# Altium schematic sheet 1_P1.schdoc
size 417 x 295 mm
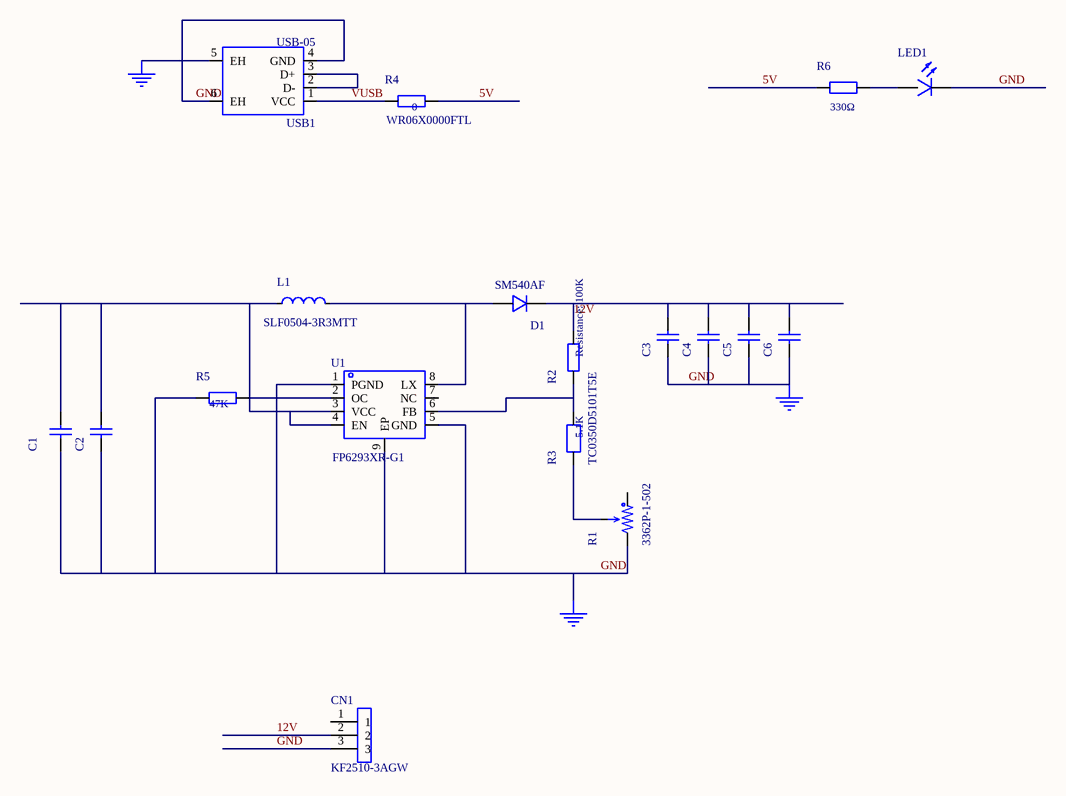
[diagram p0: 1_P1.schdoc]

## Parts
C1  (no value)  [C0805]
C2  (no value)  [C0805]
C3  (no value)  [C0805]
C4  (no value)  [C0805]
C5  (no value)  [C0805]
C6  (no value)  [C0805]
CN1  (no value)  [HDR-TH_3P-P2.54-H-W10.0]
D1  (no value)  [SMAF_L3.5-W2.6-LS4.7-RD]
L1  (no value)  [IND-SMD_L5.8-W5.2]
LED1  (no value)  [LED0603-R-RD]
R1  (no value)  [RES-ADJ-TH_3362P]
R2  Resistance: 100K  [R0805]
R3  Resistance: 5.1K  [R0603]
R4  Resistance: 0  [R0603]
R5  Resistance: 47K  [R0603]
R6  Resistance: 330Ω  [R0603]
U1  (no value)  [SOP-8_L4.9-W3.9-P1.27-LS6.0-BL-EP]
USB1  (no value)  [USB-A-TH_48037-0001]

## Nets
GND: C1.1 C2.1 C3.1 C4.1 C5.1 C6.1 CN1.3 LED1.2(C) R1.3 R5.1 U1.1(PGND) U1.5(GND) U1.9(EP) USB1.4(GND) USB1.5(EH) USB1.6(EH)
5V: R4.2 R6.1
12V: C3.2 C4.2 C5.2 C6.2 CN1.2 D1.1(C) R2.2
VUSB: R4.1 USB1.1(VCC)
NetC1_2: C1.2 C2.2 L1.1 R5.2 U1.2(OC) U1.3(VCC) U1.4(EN)
NetD1_2: D1.2(A) L1.2 U1.8(LX)
NetLED1_1: LED1.1(A) R6.2
NetR1_2: R1.2 R3.1
NetR2_1: R2.1 R3.2 U1.6(FB)
NetUSB1_2: USB1.2(D-) USB1.3(D+)

Not connected (* = marked no-connect by the designer): CN1 1; R1 1; U1 7(NC)

## Library data of the parts
C1-C6 = CL21A106KAYNNNE: Manufacturer: SAMSUNG(三星); Add into BOM: yes; Tolerance: ±10%; Capacitance: 10uF; Voltage - Rated: 25V; Temperature Coefficient: X5R; Description: 精度:±10%;容值:10uF;额定电压:25V;温漂系数（介质材料):X5R;; Symbol: CL21A106KAYNNNE; Device: CL21A106KAYNNNE; Supplier Part: C15850; Manufacturer Part: CL21A106KAYNNNE; LCSC On Sale: 1; Supplier Footprint: 0805; JLCPCB Part Class: Basic Part; JLCPCB Stock Number: 1086342; JLCPCB On Sale: 1; Datasheet: https://atta.szlcsc.com/upload/public/pdf/source/20160103/1457707679302.pdf; Supplier: LCSC; Convert to PCB: yes
CN1 = KF2510-3AGW: Manufacturer: BOOMELE(博穆精密); Add into BOM: yes; Number of Positions: 3; Connector Type: 接头; Pitch: 0.100"(2.54mm); Description: 针脚数:3;连接器类型:接头;系列:-;间距:0.100"(2.54mm);触头类型:公形引脚;; Symbol: KF2510-3AGW; Device: KF2510-3AGW; Supplier Part: C68663; Manufacturer Part: KF2510-3AGW; LCSC On Sale: 1; Supplier Footprint: -; JLCPCB Part Class: Extended Part; JLCPCB Stock Number: 350; JLCPCB On Sale: 1; Datasheet: https://atta.szlcsc.com/upload/public/pdf/source/20160329/1459215858464.pdf; Supplier: LCSC; Convert to PCB: yes; Contact Material: -; Number of Rows: 1; Series: -; Contact Type: 公形引脚; Mounting Type: 通孔,直角; Row Spacing: -
D1 = SM540AF: Manufacturer: LRC(乐山无线电); Add into BOM: yes; Voltage - DC Reverse (Vr) (Max): 40V; Current - Average Rectified (Io): 5A; Voltage - Forward (Vf) (Max) @ If: 510mV @ 5A; Description: 直流反向耐压（Vr）:40V;平均整流电流（Io）:5A;正向压降（Vf）:510mV @ 5A;; Paste Type: Extended Part; Symbol: SM540AF; Device: SM540AF; Supplier Part: C172443; Manufacturer Part: SM540AF; LCSC On Sale: 1; Supplier Footprint: SMA-FL; JLCPCB Part Class: Extended Part; JLCPCB Stock Number: 2819; JLCPCB On Sale: 1; Datasheet: https://atta.szlcsc.com/upload/public/pdf/source/20180130/C172443_15172974425221323472.pdf; Supplier: LCSC; Convert to PCB: yes
L1 = SLF0504-3R3MTT: Manufacturer: Sunltech(韩国顺磁); Add into BOM: yes; Tolerance: ±20%; Rated current: 3.3A; DC Resistance (DCR): 45mΩ; Inductance: 3.3uH; Description: 精度:±20%;额定电流:3.3A;直流电阻（内阻）:45mΩ;电感值:3.3uH;; Symbol: SLF0504-3R3MTT; Device: SLF0504-3R3MTT; Supplier Part: C242302; Manufacturer Part: SLF0504-3R3MTT; LCSC On Sale: 1; Supplier Footprint: SMD,5.8x5.2x4.5mm; JLCPCB Part Class: Extended Part; JLCPCB Stock Number: 115; JLCPCB On Sale: 1; Datasheet: https://atta.szlcsc.com/upload/public/pdf/source/20180629/C242302_76BAB8724FAAAA60915BBC1280CB54EC.PDF; Supplier: LCSC; Convert to PCB: yes
LED1 = 19-217/R6C-AL1M2VY/3T: Manufacturer: EVERLIGHT(台湾亿光); Add into BOM: yes; Illumination Color: 红色; Dominant Wavelength / Coordinate rank: 617.5~633.5nm; Luminous Intensity (IF=20mA): 11.5~28.5mcd@5mA; Description: 照明颜色:红色;主波长/色坐标:617.5~633.5nm;; Symbol: 19-217/R6C-AL1M2VY/3T; Device: 19-217/R6C-AL1M2VY/3T; Supplier Part: C72044; Manufacturer Part: 19-217/R6C-AL1M2VY/3T; LCSC On Sale: 1; Supplier Footprint: 0603; JLCPCB Part Class: Extended Part; JLCPCB On Sale: 1; Datasheet: https://atta.szlcsc.com/upload/public/pdf/source/20160507/1462613613821.pdf; Supplier: LCSC; Convert to PCB: yes; Mounting Type: 表面贴装; JLCPCB Stock: 26629
R1 = 3362P-1-502: Manufacturer: BOCHEN(博晨); Add into BOM: yes; Tolerance: ±10%; Temperature Coefficient: ±250ppm/℃; Resistance: 5K; Symbol: 3362P-1-502; Device: 3362P-1-502; Supplier Part: C118903; Manufacturer Part: 3362P-1-502; LCSC On Sale: 1; Supplier Footprint: 3362P; JLCPCB Part Class: Extended Part; JLCPCB Stock Number: 3578; JLCPCB On Sale: 1; Datasheet: https://atta.szlcsc.com/upload/public/pdf/source/20171114/C118903_15106326539181117393.pdf; Supplier: LCSC; Convert to PCB: yes
R2 = TC0525F1003T5E: Manufacturer: UNI-ROYAL(厚声); Add into BOM: yes; Tolerance: ±1%; Power (Watts): 1/4W; Temperature Coefficient: ±25ppm/℃; Description: 阻值（欧姆）:100K;精度:±1%;功率:1/4W;温度系数:±25ppm/℃;; Symbol: TC0525F1003T5E; Device: TC0525F1003T5E; Supplier Part: C57246; Manufacturer Part: TC0525F1003T5E; LCSC On Sale: 1; Supplier Footprint: 0805; JLCPCB Part Class: Extended Part; JLCPCB Stock Number: 220; JLCPCB On Sale: 1; Datasheet: https://atta.szlcsc.com/upload/public/pdf/source/20190404/C57246_427FA7655752201ADA4A1EA21B0895D2.pdf; Supplier: LCSC; Convert to PCB: yes; Mounting Type: 表面贴装
R3 = TC0350D5101T5E: Manufacturer: UNI-ROYAL(厚声); Add into BOM: yes; Tolerance: ±0.5%; Power (Watts): 1/6W; Temperature Coefficient: ±50ppm/℃; Description: 阻值（欧姆）:5.1K;精度:±0.5%;功率:1/6W;温度系数:±50ppm/℃;; Symbol: TC0350D5101T5E; Device: TC0350D5101T5E; Supplier Part: C415076; Manufacturer Part: TC0350D5101T5E; LCSC On Sale: 1; Supplier Footprint: 0603; JLCPCB Part Class: Extended Part; JLCPCB Stock Number: 0; Datasheet: https://atta.szlcsc.com/upload/public/pdf/source/20190821/C415076_3D31B4528E75A162971CB39437F9DEA8.pdf; Supplier: LCSC; Convert to PCB: yes; Mounting Type: 表面贴装
R4 = WR06X0000FTL: Manufacturer: 华新科(Walsin); Add into BOM: yes; Tolerance: ±1%; Description: 精度:±1%;温度系数:-200ppm/℃~+400ppm/℃;温度系数:-200ppm/℃~+400ppm/℃;功率:0.1W;阻值:0Ω;; Paste Type: Extended Part; Symbol: WR06X0000FTL; Device: WR06X0000FTL; Supplier Part: C163836; Manufacturer Part: WR06X0000FTL; LCSC On Sale: 1; Supplier Footprint: 0603; JLCPCB Part Class: Extended Part; JLCPCB Stock Number: 471450; JLCPCB On Sale: 1; Datasheet: https://atta.szlcsc.com/upload/public/pdf/source/20180228/C163836_15198053451511377210.pdf; Supplier: LCSC; Convert to PCB: yes
R5 = WR06X4702FTL: Manufacturer: 华新科(Walsin); Add into BOM: yes; Tolerance: ±1%; Description: 阻值:47kΩ;精度:±1%;温度系数:±100ppm/℃;温度系数:±100ppm/℃;功率:0.1W;; Symbol: WR06X4702FTL; Device: WR06X4702FTL; Supplier Part: C146207; Manufacturer Part: WR06X4702FTL; LCSC On Sale: 1; Supplier Footprint: 0603; JLCPCB Part Class: Extended Part; JLCPCB Stock Number: 154450; JLCPCB On Sale: 1; Datasheet: https://atta.szlcsc.com/upload/public/pdf/source/20180228/C146207_15198053081871377160.pdf; Supplier: LCSC; Convert to PCB: yes
R6 = 0603WAJ0331T5E: Manufacturer: UNI-ROYAL(厚声); Add into BOM: yes; Tolerance: ±5%; Temperature Coefficient: ±100ppm/℃; Power(Watts): 0.1W; Description: 阻值:330Ω;精度:±5%;温度系数:±100ppm/℃;温度系数:±100ppm/℃;功率:0.1W;; Symbol: 0603WAJ0331T5E; Device: 0603WAJ0331T5E; Supplier Part: C25231; Manufacturer Part: 0603WAJ0331T5E; LCSC On Sale: 1; Supplier Footprint: 0603; JLCPCB Part Class: Extended Part; JLCPCB On Sale: 1; Datasheet: https://atta.szlcsc.com/upload/public/pdf/source/20170920/C25231_1505901278262982857.pdf; Supplier: LCSC; Convert to PCB: yes; JLCPCB Stock: 9021
U1 = FP6293XR-G1: Manufacturer: Feeling Technology(台湾远翔); Add into BOM: yes; Voltage - Output (Max): 13V; Current - Output: 3.5A; Frequency - Switching: 1MHz; Output Type: Adjustable; Number of Outputs: 1; Voltage - Input (Min): 2.6V; Voltage - Input (Max): 5.5V; Topology: Boost; Function: Step-Up; Output Configuration: Positive; Description: 可输出电流:3.5A;最大输入电压:5.5V;; Symbol: FP6293XR-G1; Device: FP6293XR-G1; Supplier Part: C83576; Manufacturer Part: FP6293XR-G1; LCSC On Sale: 1; Supplier Footprint: SOP-8_EP_150mil; JLCPCB Part Class: Extended Part; JLCPCB Stock Number: 55; JLCPCB On Sale: 1; Datasheet: https://atta.szlcsc.com/upload/public/pdf/source/20161012/1476236733261.pdf; Supplier: LCSC; Convert to PCB: yes; Voltage - Output (Min/Fixed): -; Synchronous Rectifier: -
USB1 = USB-05: Manufacturer: SOFNG(硕方); Add into BOM: yes; Number of Ports: 1; Mounting Angle: 垂直; Gender: 插头; Connector Type: USB - Type A; Number of Contacts: 4; Description: USB A USB 公头; Symbol: USB-05; Device: USB-05; Supplier Part: C112454; Manufacturer Part: USB-05; LCSC On Sale: 1; Supplier Footprint: 插件; JLCPCB Part Class: Extended Part; JLCPCB Stock Number: 8870; JLCPCB On Sale: 1; Datasheet: https://atta.szlcsc.com/upload/public/pdf/source/20170712/C112454_1499827709129813365.pdf; Supplier: LCSC; Convert to PCB: yes; Termination Style: 焊接; Current Rating: -; Standard: USB 2